# EAGLE design untitled (EAGLE 7.6.0)
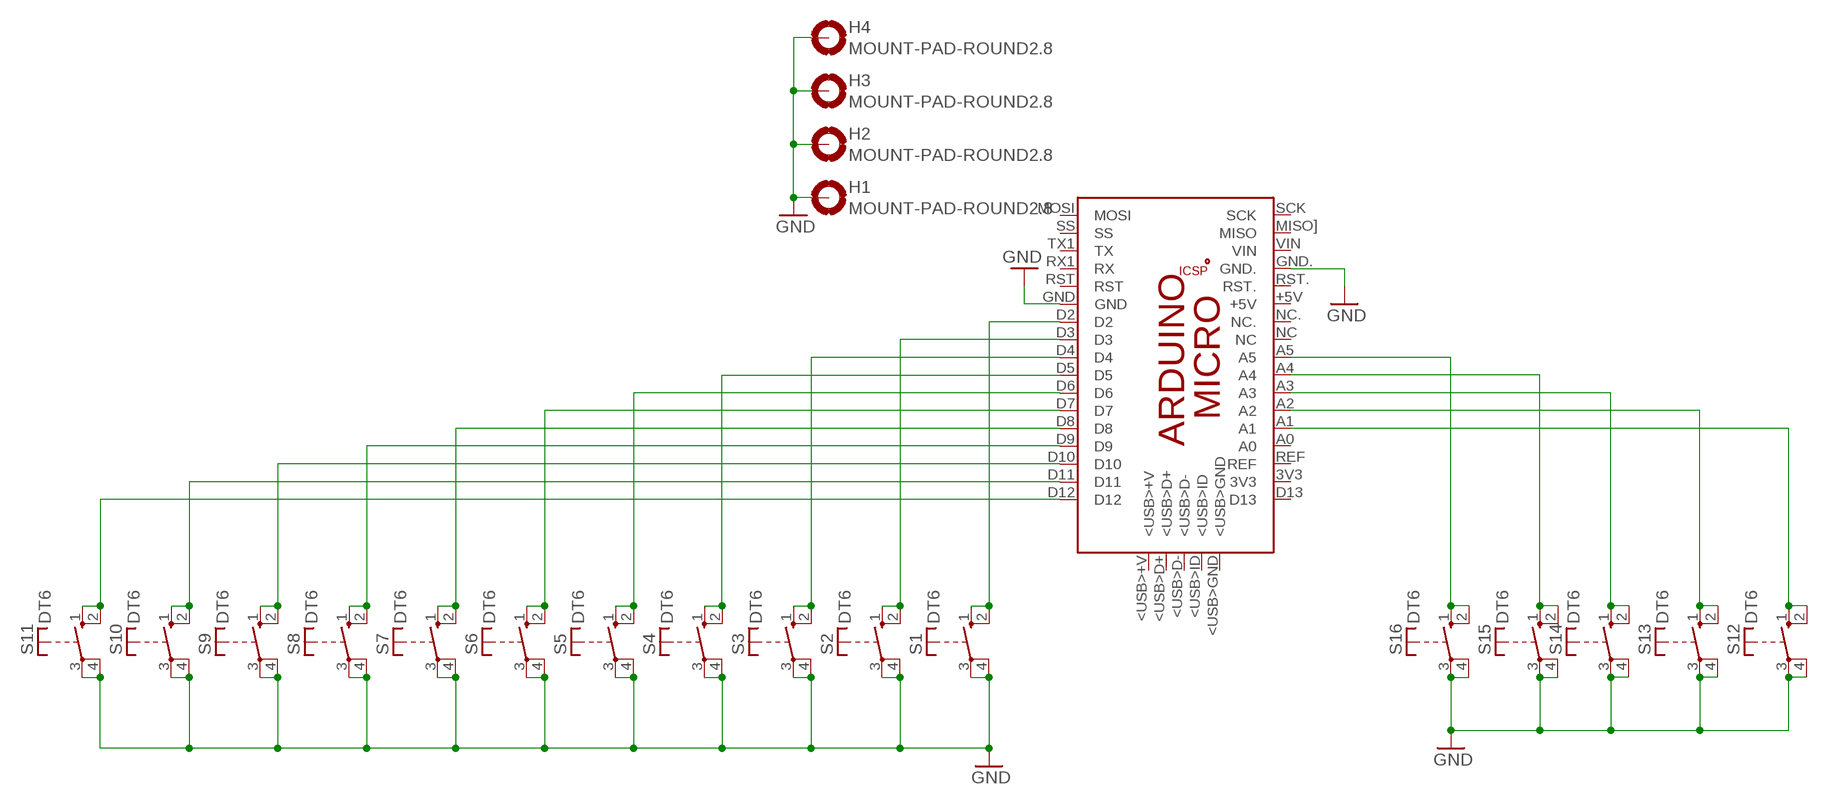
[diagram p0: schematic, sheet 1]

## Parts
H1  MOUNT-PAD-ROUND2.8  [2,8-PAD]
H2  MOUNT-PAD-ROUND2.8  [2,8-PAD]
H3  MOUNT-PAD-ROUND2.8  [2,8-PAD]
H4  MOUNT-PAD-ROUND2.8  [2,8-PAD]
PCB2  ARDUINO_MICRO  [ARDUINO_MICRO]
S1  DT6  [DT6]
S2  DT6  [DT6]
S3  DT6  [DT6]
S4  DT6  [DT6]
S5  DT6  [DT6]
S6  DT6  [DT6]
S7  DT6  [DT6]
S8  DT6  [DT6]
S9  DT6  [DT6]
S10  DT6  [DT6]
S11  DT6  [DT6]
S12  DT6  [DT6]
S13  DT6  [DT6]
S14  DT6  [DT6]
S15  DT6  [DT6]
S16  DT6  [DT6]

## Nets
GND: H1.B2,8(MOUNT) H2.B2,8(MOUNT) H3.B2,8(MOUNT) H4.B2,8(MOUNT) PCB2.GND PCB2.GND. S1.3(P) S1.4(P) S2.3(P) S2.4(P) S3.3(P) S3.4(P) S4.3(P) S4.4(P) S5.3(P) S5.4(P) S6.3(P) S6.4(P) S7.3(P) S7.4(P) S8.3(P) S8.4(P) S9.3(P) S9.4(P) S10.3(P) S10.4(P) S11.3(P) S11.4(P) S12.3(P) S12.4(P) S13.3(P) S13.4(P) S14.3(P) S14.4(P) S15.3(P) S15.4(P) S16.3(P) S16.4(P)
N$1: PCB2.D2 S1.1(S) S1.2(S)
N$2: PCB2.D3 S2.1(S) S2.2(S)
N$3: PCB2.D4 S3.1(S) S3.2(S)
N$4: PCB2.D5 S4.1(S) S4.2(S)
N$5: PCB2.D6 S5.1(S) S5.2(S)
N$6: PCB2.D7 S6.1(S) S6.2(S)
N$7: PCB2.D8 S7.1(S) S7.2(S)
N$8: PCB2.D9 S8.1(S) S8.2(S)
N$9: PCB2.D10 S9.1(S) S9.2(S)
N$10: PCB2.D11 S10.1(S) S10.2(S)
N$11: PCB2.D12 S11.1(S) S11.2(S)
N$12: PCB2.A5 S16.1(S) S16.2(S)
N$13: PCB2.A4 S15.1(S) S15.2(S)
N$14: PCB2.A3 S14.1(S) S14.2(S)
N$15: PCB2.A2 S13.1(S) S13.2(S)
N$16: PCB2.A1 S12.1(S) S12.2(S)
Unconnected: PCB2.3V3 PCB2.5V PCB2.+5V PCB2.<USB>+V PCB2.<USB>D+ PCB2.<USB>D- PCB2.<USB>GND PCB2.<USB>ID PCB2.A0 PCB2.D13 PCB2.GND_ PCB2.MISO. PCB2.MISO](MISO) PCB2.MOSI PCB2.MOSI. PCB2.NC PCB2.NC. PCB2.REF PCB2.RESET.. PCB2.RST PCB2.RST. PCB2.RX1(RX) PCB2.SCK PCB2.SCK. PCB2.SS PCB2.TX1(TX) PCB2.VIN

## Library data of the parts
H1-H4 = holes:MOUNT-PAD-ROUND: MOUNTING PAD, round
PCB2 = E14_Arduino_revC:ARDUINO_MICRO: Device for representing an Arduino Micro board with a footprint in an EAGLE design. Created by Dave Young for Element14. More EAGLE documentation at: http://www.element14.com/community/community/knode/cadsoft_eagle
S1-S16 = switch-misc:DT: ITT SWITCH

## Board
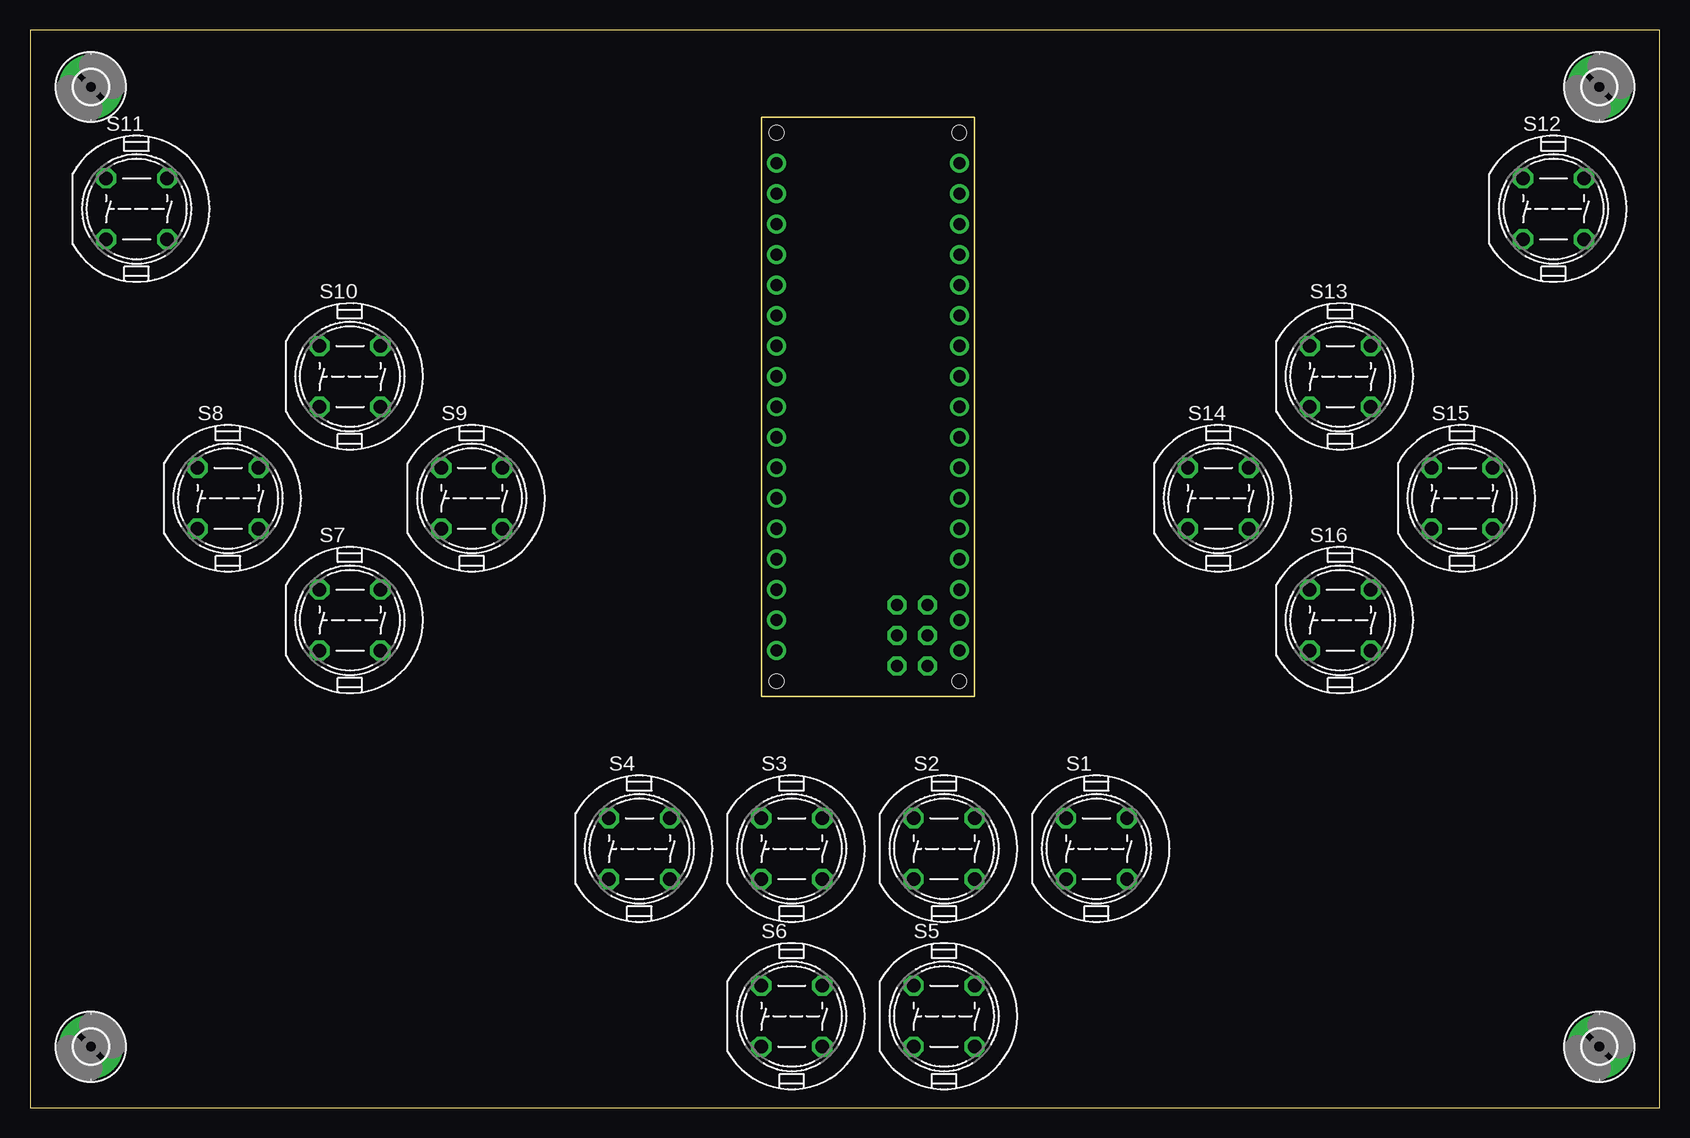
[diagram p1: board, top side]
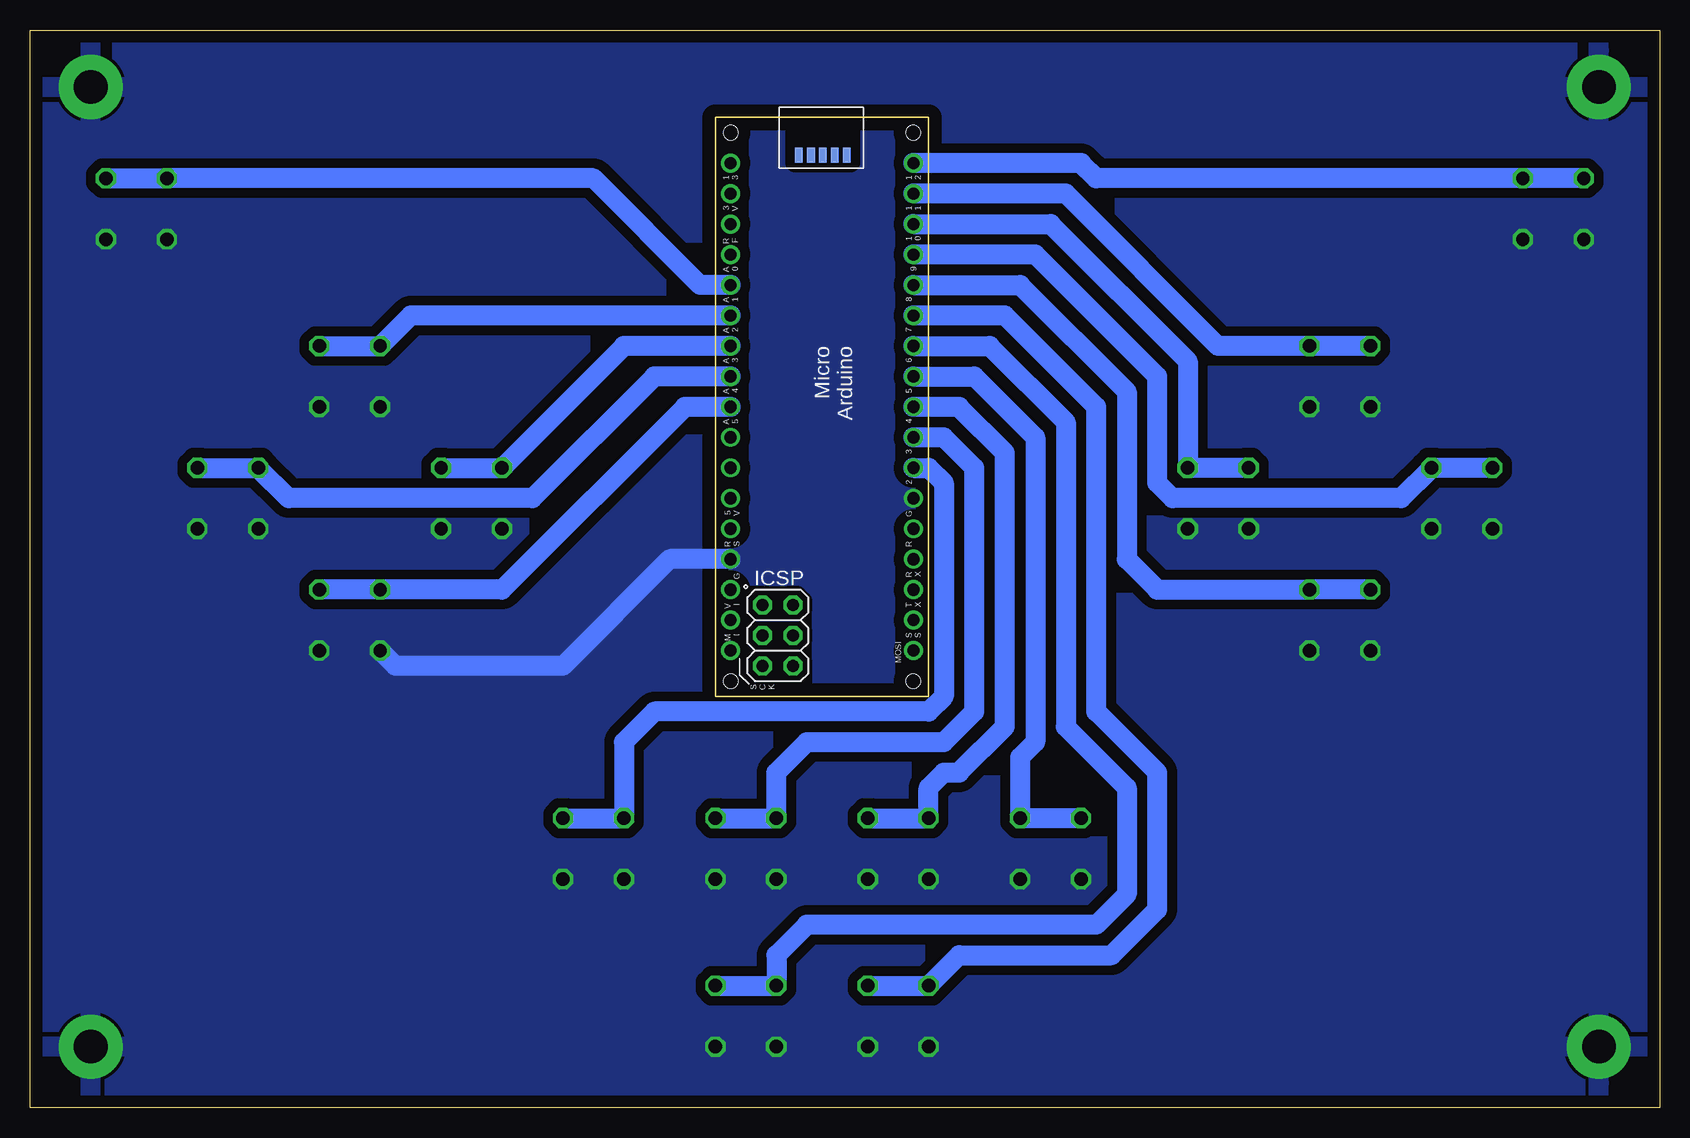
[diagram p2: board, bottom side, seen from below]

Size 135.87 x 89.84 mm. Coordinates in mm from the lower left corner, seen from the top.
Outline: 0,0 135.87,0 135.87,89.84 0,89.84 0,0
Copper layers (1*16): Top 0.035mm / dielectric 1.5mm / Bottom 0.035mm
Design rules "default": minimum track width 10mil, minimum drill 24mil, track to track 8mil, track to pad 8mil, pad to pad 8mil, via to via 8mil, smd to smd 8mil, copper to edge 40mil, drill to drill 8mil, minimum pad ring 10mil, minimum via ring 8mil, stop-mask expansion 4mil, vias tented up to drill 0mil, thermal gap 10mil

### Footprints (pad centres in the part's own frame; a part is rotated, then mirrored left to right if it is on the bottom)
2,8-PAD = drill 2.8 pad 5.334: B2,8 0,0
ARDUINO_MICRO = drill 1.016 pad 1.575: 3V3 6.35,1.27; +5V 31.75,1.27; A0 11.43,1.27; A1 13.97,1.27; A2 16.51,1.27; A3 19.05,1.27; A4 21.59,1.27; A5 24.13,1.27; D2 29.21,16.51; D3 26.67,16.51; D4 24.13,16.51; D5 21.59,16.51; D6 19.05,16.51; D7 16.51,16.51; D8 13.97,16.51; D9 11.43,16.51; D10 8.89,16.51; D11 6.35,16.51; D12 3.81,16.51; D13 3.81,1.27; GND 31.75,16.51; GND. 36.83,1.27; MISO] 41.91,1.27; MOSI 44.45,16.51; NC 26.67,1.27; NC. 29.21,1.27; REF 8.89,1.27; RST 34.29,16.51; RST. 34.29,1.27; RX1 36.83,16.51; SCK 44.45,1.27; SS 41.91,16.51; TX1 39.37,16.51; VIN 39.37,1.27 | drill 1.016 pad 1.575 octagon: 5V 40.64,6.477; GND_ 45.72,6.477; MISO. 40.64,3.937; MOSI. 43.18,6.477; RESET.. 45.72,3.937; SCK. 43.18,3.937 | smd 1.27 x 0.635: <USB>+V 3.15,10.947; <USB>D+ 3.15,9.957; <USB>D- 3.15,8.941; <USB>GND 3.15,6.96; <USB>ID 3.15,7.976 | hole 1.2: 1.27,1.27; 1.27,16.51; 46.99,16.51; 46.99,1.27
DT6 = drill 1.118 octagon: 1 -2.54,2.54; 2 2.54,2.54; 3 2.54,-2.54; 4 -2.54,-2.54

### Placement (x,y rotation side)
H1  5.08,5.08 0 top
H2  130.81,5.08 0 top
H3  130.81,85.09 0 top
H4  5.08,85.09 0 top
PCB2  78.74,82.55 270 bottom
S1  88.9,21.59 0 top
S2  76.2,21.59 0 top
S3  63.5,21.59 0 top
S4  50.8,21.59 0 top
S5  76.2,7.62 0 top
S6  63.5,7.62 0 top
S7  26.67,40.64 0 top
S8  16.51,50.8 0 top
S9  36.83,50.8 0 top
S10  26.67,60.96 0 top
S11  8.89,74.93 0 top
S12  127,74.93 0 top
S13  109.22,60.96 0 top
S14  99.06,50.8 0 top
S15  119.38,50.8 0 top
S16  109.22,40.64 0 top

### Tracks (layer width: path | path; a pad name or v marks a point on that pad's centre or on a via)
GND
  Bottom 1.676: PCB2.GND. 82.55,45.72 91.44,36.83 105.41,36.83 S16.4
  pour Bottom (isolate 0.813): 0,90.17 135.89,90.17 135.89,0 0,0
N$1
  Bottom 1.676: PCB2.D2 60.96,53.34 59.69,52.07 59.69,34.29 60.96,33.02 83.82,33.02 86.36,30.48 S1.1 S1.2
N$2
  Bottom 1.676: PCB2.D3 59.69,55.88 57.15,53.34 57.15,33.02 59.69,30.48 71.12,30.48 73.66,27.94 S2.1 S2.2
N$3
  Bottom 1.676: PCB2.D4 58.42,58.42 54.61,54.61 54.61,31.75 58.42,27.94 59.69,27.94 60.96,26.67 S3.1 S3.2
N$4
  Bottom 1.676: PCB2.D5 57.15,60.96 52.07,55.88 52.07,30.48 53.34,29.21 S4.2 S4.1
N$5
  Bottom 1.676: PCB2.D6 55.88,63.5 49.53,57.15 49.53,31.75 44.45,26.67 44.45,17.78 46.99,15.24 71.12,15.24 73.66,12.7 S5.1 S5.2
N$6
  Bottom 1.676: PCB2.D7 54.61,66.04 46.99,58.42 46.99,33.02 41.91,27.94 41.91,16.51 45.72,12.7 58.42,12.7 S6.1 S6.2
N$7
  Bottom 1.676: PCB2.D8 53.34,68.58 44.45,59.69 44.45,45.72 41.91,43.18 S7.2 S7.1
N$8
  Bottom 1.676: PCB2.D9 52.07,71.12 41.91,60.96 41.91,52.07 40.64,50.8 21.59,50.8 S8.2 S8.1
N$9
  Bottom 1.676: PCB2.D10 50.8,73.66 39.37,62.23 S9.2 S9.1
N$10
  Bottom 1.676: PCB2.D11 49.53,76.2 36.83,63.5 S10.2 S10.1
N$11
  Bottom 1.676: PCB2.D12 48.26,78.74 46.99,77.47 S11.2 S11.1
N$12
  Bottom 1.676: PCB2.A5 81.28,58.42 96.52,43.18 S16.1 S16.2
N$13
  Bottom 1.676: PCB2.A4 83.82,60.96 93.98,50.8 114.3,50.8 S15.1 S15.2
N$14
  Bottom 1.676: PCB2.A3 86.36,63.5 S14.1 S14.2
N$15
  Bottom 1.676: S13.2 S13.1 104.14,66.04 PCB2.A2
N$16
  Bottom 1.676: PCB2.A1 80.01,68.58 88.9,77.47 S12.1 S12.2